# Altium project gameConsole.PrjPcb
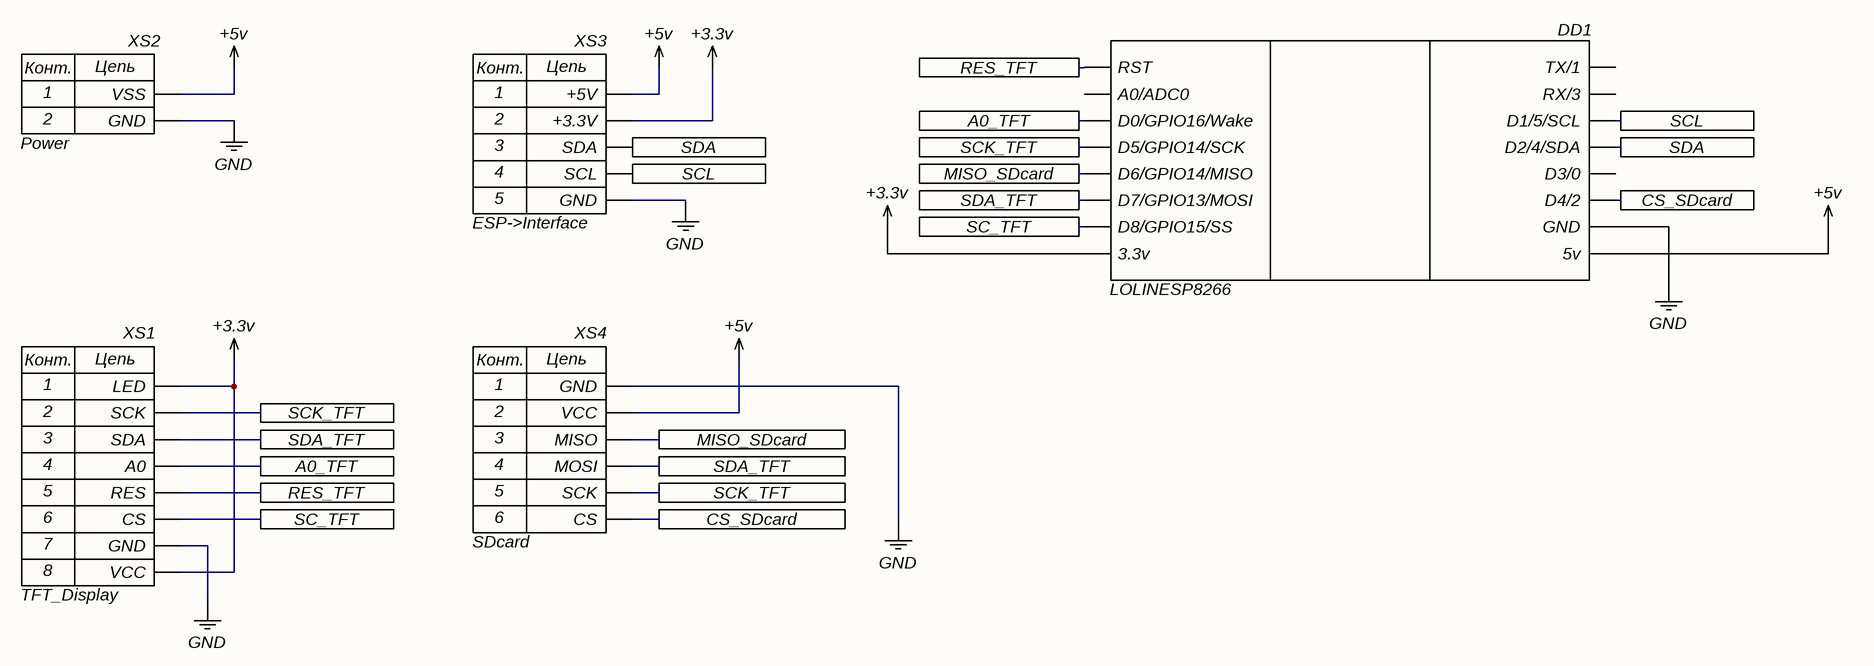
[diagram p0: Sheet1.SchDoc]
1 sheet, 5 parts. Net scope: flat (ports and power ports of the same name join across sheets).
Board file: PCB1.PcbDoc

## Sheet Sheet1.SchDoc
size A3; SheetNumber: 1; SheetTotal: 1

### Parts
DD1  LOLINESP8266  [ESP8266Wemos]
XS1  TFT_Display  [PinOutX8]
XS2  Power  [Power]
XS3  ESP->Interface  [PinOutX5]
XS4  SDcard  [PinOutX6]

### Ports
A0_TFT (see Sheet1[2B]), A0_TFT (see Sheet1[4A]), CS_SDcard (see Sheet1[3B]), CS_SDcard (see Sheet1[7A]), MISO_SDcard (see Sheet1[3B]), MISO_SDcard (see Sheet1[4A]), RES_TFT (see Sheet1[2B]), RES_TFT (see Sheet1[4A]), SC_TFT (see Sheet1[2B]), SC_TFT (see Sheet1[4A]), SCK_TFT (see Sheet1[2B], Sheet1[3B]), SCK_TFT (see Sheet1[2B], Sheet1[4A]), SCK_TFT (see Sheet1[3B], Sheet1[4A]), SCL (see Sheet1[3A]), SCL (see Sheet1[7A]), SDA (see Sheet1[3A]), SDA (see Sheet1[7A]), SDA_TFT (see Sheet1[2B], Sheet1[3B]), SDA_TFT (see Sheet1[2B], Sheet1[4A]), SDA_TFT (see Sheet1[3B], Sheet1[4A])

### Nets
+3.3v: DD1.8(3.3v) XS1.1(LED) XS1.8(VCC) XS3.2(+3.3V)
+5v: DD1.9(5v) XS2.1(VSS) XS3.1(+5V) XS4.2(VCC)
GND: DD1.10(GND) XS1.7(GND) XS2.2(GND) XS3.5(GND) XS4.1(GND)
NetDD1_1: DD1.1(RST) XS1.5(RES) ; port RES_TFT
NetDD1_3: DD1.3(D0/GPIO16/Wake) XS1.4(A0) ; port A0_TFT
NetDD1_4: DD1.4(D5/GPIO14/SCK) XS1.2(SCK) XS4.5(SCK) ; port SCK_TFT
NetDD1_5: DD1.5(D6/GPIO14/MISO) XS4.3(MISO) ; port MISO_SDcard
NetDD1_6: DD1.6(D7/GPIO13/MOSI) XS1.3(SDA) XS4.4(MOSI) ; port SDA_TFT
NetDD1_7: DD1.7(D8/GPIO15/SS) XS1.6(CS) ; port SC_TFT
NetDD1_11: DD1.11(D4/2) XS4.6(CS) ; port CS_SDcard
NetDD1_13: DD1.13(D2/4/SDA) XS3.3(SDA) ; port SDA
NetDD1_14: DD1.14(D1/5/SCL) XS3.4(SCL) ; port SCL

Not connected (* = marked no-connect by the designer): DD1 2(A0/ADC0) 12(D3/0) 15(RX/3) 16(TX/1)

### Notes on the sheet
- (in symbol ESP->Interface) Конт.; Цепь
- (in symbol Power) Конт.; Цепь
- (in symbol SDcard) Конт.; Цепь